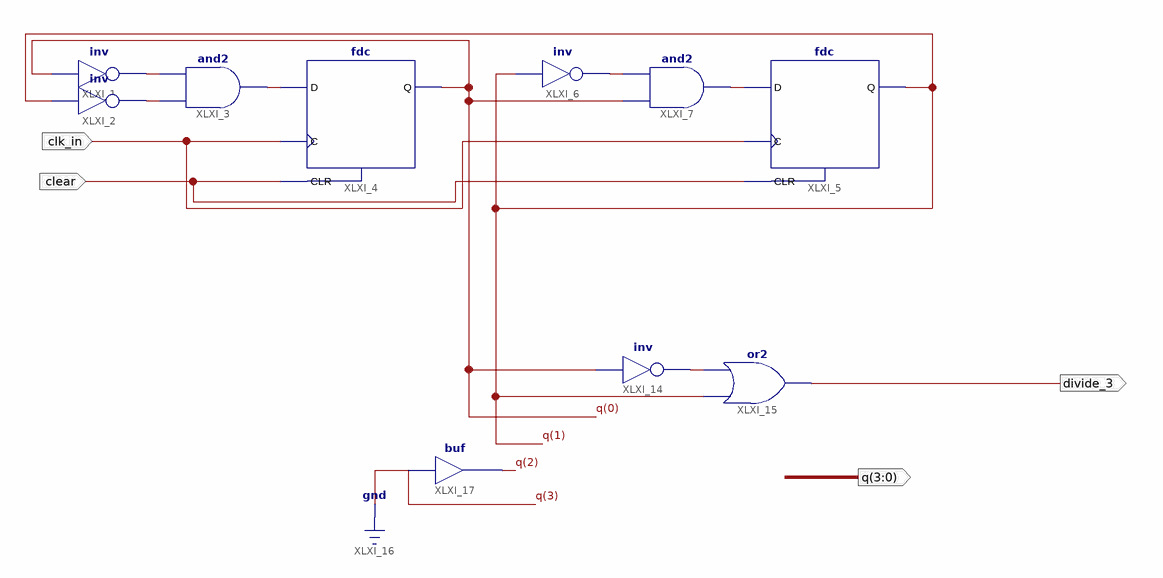
[diagram p0: schematic sheet 1]
// Xilinx ISE schematic counter02.sch (spartan6) as structural Verilog: 10 symbols, 4 ports
module counter02 (
  input  clk_in,
  input  clear,
  output divide_3,
  output [3:0] q
);

  wire XLXN_1, XLXN_2, XLXN_3, XLXN_4, XLXN_14, XLXN_17;

  not XLXI_1 (XLXN_2, q[0]);
  not XLXI_2 (XLXN_1, q[1]);
  and XLXI_3 (XLXN_3, XLXN_1, XLXN_2);
  fdc XLXI_4 (.C(clk_in), .CLR(clear), .D(XLXN_3), .Q(q[0]));
  fdc XLXI_5 (.C(clk_in), .CLR(clear), .D(XLXN_14), .Q(q[1]));
  not XLXI_6 (XLXN_4, q[1]);
  and XLXI_7 (XLXN_14, q[0], XLXN_4);
  not XLXI_14 (XLXN_17, q[0]);
  or XLXI_15 (divide_3, q[1], XLXN_17);
  buf XLXI_17 (q[2], 1'b0);

  assign q[3] = 1'b0;
endmodule
